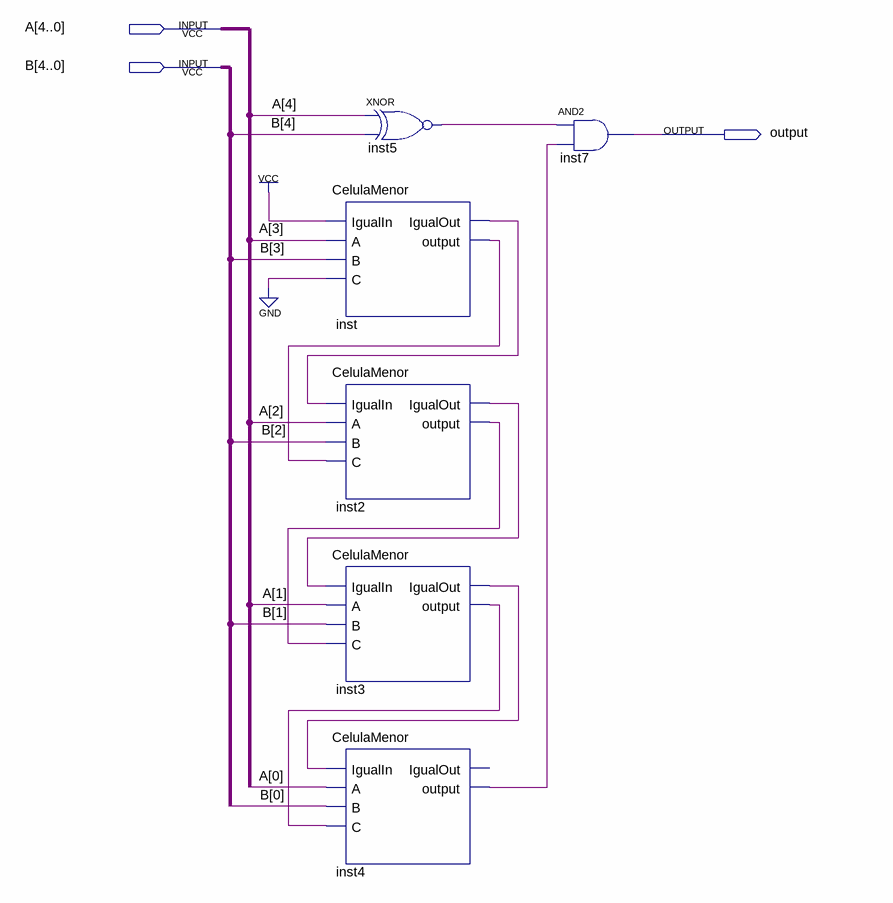
[diagram p0: schematic sheet]
// Quartus schematic MenorCompleto.bdf as structural Verilog: 6 symbols, 3 pins
module MenorCompleto (
  input  [4:0] A,
  input  [4:0] B,
  output \output 
);

  wire inst2_igualout, inst2_output, inst3_igualout, inst3_output, inst4_output, inst5_out, inst_igualout,
       inst_output;

  CelulaMenor inst (.IgualIn(1'b1), .A(A[3]), .B(B[3]), .C(1'b0), .IgualOut(inst_igualout), .\output (inst_output));
  CelulaMenor inst2 (
    .IgualIn(inst_igualout), .A(A[2]), .B(B[2]), .C(inst_output), .IgualOut(inst2_igualout),
    .\output (inst2_output));
  CelulaMenor inst3 (
    .IgualIn(inst2_igualout), .A(A[1]), .B(B[1]), .C(inst2_output), .IgualOut(inst3_igualout),
    .\output (inst3_output));
  CelulaMenor inst4 (
    .IgualIn(inst3_igualout), .A(A[0]), .B(B[0]), .C(inst3_output), .\output (inst4_output));  // open: IgualOut
  xnor inst5 (inst5_out, A[4], B[4]);
  and inst7 (\output , inst5_out, inst4_output);
endmodule
